# Altium schematic sheet Buttons.SchDoc
size 297 x 209 mm
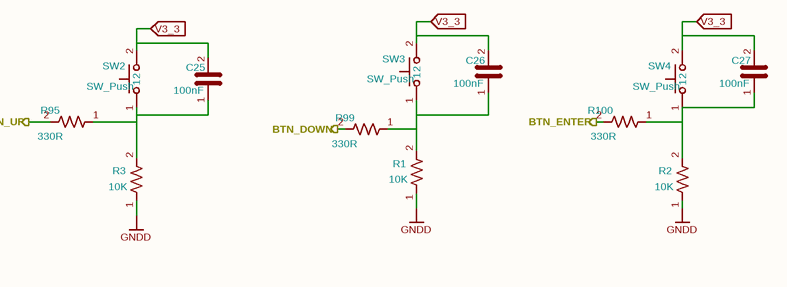
[diagram p0: Buttons.SchDoc]

## Parts
C25  100nF  [C_0603_1608Metric]
C26  100nF  [C_0603_1608Metric]
C27  100nF  [C_0603_1608Metric]
R1  10K  [R_0603_1608Metric]
R2  10K  [R_0603_1608Metric]
R3  10K  [R_0603_1608Metric]
R95  330R  [R_0603_1608Metric]
R99  330R  [R_0603_1608Metric]
R100  330R  [R_0603_1608Metric]
SW2  SW_Push  [SW_SPST_Omron_B3FS-100xP]
SW3  SW_Push  [SW_SPST_Omron_B3FS-100xP]
SW4  SW_Push  [SW_SPST_Omron_B3FS-100xP]

## Ports
BTN_DOWN (out), BTN_ENTER (out), BTN_UP (out), V3_3 (in)

## Nets
GNDD: R1.1 R2.1 R3.1
BTN_DOWN: R99.2 ; port BTN_DOWN
BTN_ENTER: R100.2 ; port BTN_ENTER
BTN_UP: R95.2 ; port BTN_UP
V3_3: C25.2 C26.2 C27.2 SW2.2 SW3.2 SW4.2 ; port V3_3
NetC25_1: C25.1 R3.2 R95.1 SW2.1
NetC26_1: C26.1 R1.2 R99.1 SW3.1
NetC27_1: C27.1 R2.2 R100.1 SW4.1

## Notes on the sheet
- 1
- 2
- 3
- 4
- 5
- 6
- A
- B
- C
- D
- Title:
- File: Buttons.kicad_sch
- Sheet: /
- KiCad E.D.A.  kicad (5.1.4)-1
- Size: A4
- Date:
- Rev:
- Id: 1/1

## Library data of the parts
C25-C27 = C_3: Description: X7R 100nF 50V ±10% 0603 Multilayer Ceramic; MP: CC0603KRX7R9BB104; MF: YAGEO; Package: C_0603; Value: 100nF; Footprint: Capacitor_SMD:C_0603_1608Metric
R1-R3 = R_US: Description: 100mW Thick Film Resistors 75V ±100ppm/℃ ±5% 10kΩ 0603 Chip Resistor - Surface Mount ROHS; MP: FRC0603J103TS; MF: FOJAN; Package: R_0603; Value: 10K; Footprint: Resistor_SMD:R_0603_1608Metric
R95 R99 R100 = R_US: Description: RES 330Ω ±5% 100mW 0603; MP: FRC0603J331 TS; MF: FOJAN; Package: R_0603; Value: 330R; Footprint: Resistor_SMD:R_0603_1608Metric
SW2-SW4 = SW_Push: Description: Height 8mm SMD,12x12mm Tactile Switches RoHS; MP: KH-12X12X8H-SMT; MF: kinghelm; Package: SMD,12x12mm; Value: SW_Push; Footprint: Button_Switch_SMD:SW_SPST_Omron_B3FS-100xP